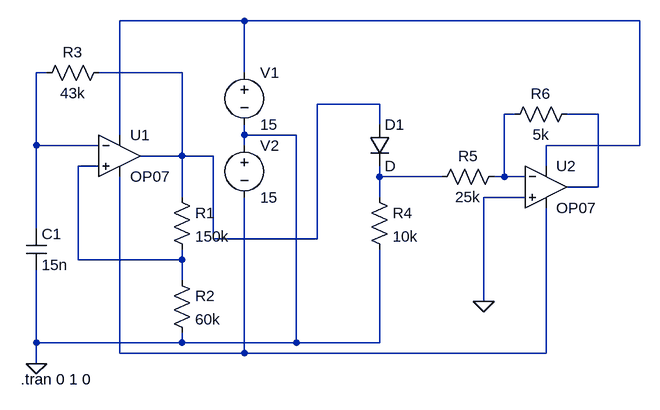
[diagram p0: schematic cap.asc]
cap.asc, the LTspice schematic file:
Version 4
SHEET 1 1060 680
WIRE 448 -48 256 -48
WIRE 1056 -48 448 -48
WIRE 144 32 128 32
WIRE 352 32 224 32
WIRE 448 32 448 -48
WIRE 656 80 560 80
WIRE 864 96 848 96
WIRE 992 96 944 96
WIRE 656 112 656 80
WIRE 256 128 256 -48
WIRE 448 128 448 112
WIRE 528 128 448 128
WIRE 128 144 128 32
WIRE 224 144 128 144
WIRE 448 144 448 128
WIRE 1056 144 1056 -48
WIRE 1056 144 912 144
WIRE 352 160 352 32
WIRE 352 160 288 160
WIRE 400 160 352 160
WIRE 224 176 192 176
WIRE 912 176 912 144
WIRE 656 192 656 176
WIRE 752 192 656 192
WIRE 848 192 848 96
WIRE 848 192 832 192
WIRE 880 192 848 192
WIRE 992 208 992 96
WIRE 992 208 944 208
WIRE 352 224 352 160
WIRE 656 224 656 192
WIRE 880 224 816 224
WIRE 128 272 128 144
WIRE 400 288 400 160
WIRE 560 288 560 80
WIRE 560 288 400 288
WIRE 192 320 192 176
WIRE 352 320 352 304
WIRE 352 320 192 320
WIRE 352 352 352 320
WIRE 816 384 816 224
WIRE 128 448 128 336
WIRE 352 448 352 432
WIRE 352 448 128 448
WIRE 528 448 528 128
WIRE 528 448 352 448
WIRE 656 448 656 304
WIRE 656 448 528 448
WIRE 256 464 256 192
WIRE 448 464 448 224
WIRE 448 464 256 464
WIRE 912 464 912 240
WIRE 912 464 448 464
WIRE 128 480 128 448
FLAG 128 480 0
FLAG 816 384 0
SYMBOL OpAmps\\OP07 256 96 R0
SYMATTR InstName U1
SYMBOL voltage 448 16 R0
WINDOW 123 0 0 Left 0
WINDOW 39 0 0 Left 0
SYMATTR InstName V1
SYMATTR Value 15
SYMBOL voltage 448 128 R0
WINDOW 123 0 0 Left 0
WINDOW 39 0 0 Left 0
SYMATTR InstName V2
SYMATTR Value 15
SYMBOL res 336 208 R0
SYMATTR InstName R1
SYMATTR Value 150k
SYMBOL res 336 336 R0
SYMATTR InstName R2
SYMATTR Value 60k
SYMBOL cap 112 272 R0
SYMATTR InstName C1
SYMATTR Value 15n
SYMBOL res 240 16 R90
WINDOW 0 0 56 VBottom 2
WINDOW 3 32 56 VTop 2
SYMATTR InstName R3
SYMATTR Value 43k
SYMBOL diode 640 112 R0
SYMATTR InstName D1
SYMBOL OpAmps\\OP07 912 144 R0
SYMATTR InstName U2
SYMBOL res 848 176 R90
WINDOW 0 0 56 VBottom 2
WINDOW 3 32 56 VTop 2
SYMATTR InstName R5
SYMATTR Value 25k
SYMBOL res 848 112 R270
WINDOW 0 32 56 VTop 2
WINDOW 3 0 56 VBottom 2
SYMATTR InstName R6
SYMATTR Value 5k
SYMBOL res 640 208 R0
SYMATTR InstName R4
SYMATTR Value 10k
TEXT 104 504 Left 2 !.tran 0 1 0

The netlist it stands for:
* cap.asc
XU1 N006 N002 N001 N008 N003 LT1001  ; OP07, pins In+ In- V+ V- OUT
V1 N001 0 15
V2 0 N008 15
R1 N003 N006 150k
R2 N006 0 60k
C1 N002 0 15n
R3 N003 N002 43k
D1 N003 N007 D
XU2 0 N004 N001 N008 N005 LT1001  ; OP07, pins In+ In- V+ V- OUT
R5 N004 N007 25k
R6 N004 N005 5k
R4 N007 0 10k
.model D D
.lib standard.dio
.tran 0 1 0
.lib LTC.lib
.backanno
.end